# EAGLE design simple-loop-activevrs (EAGLE 6.6.0)

## Sheet 1 of 2
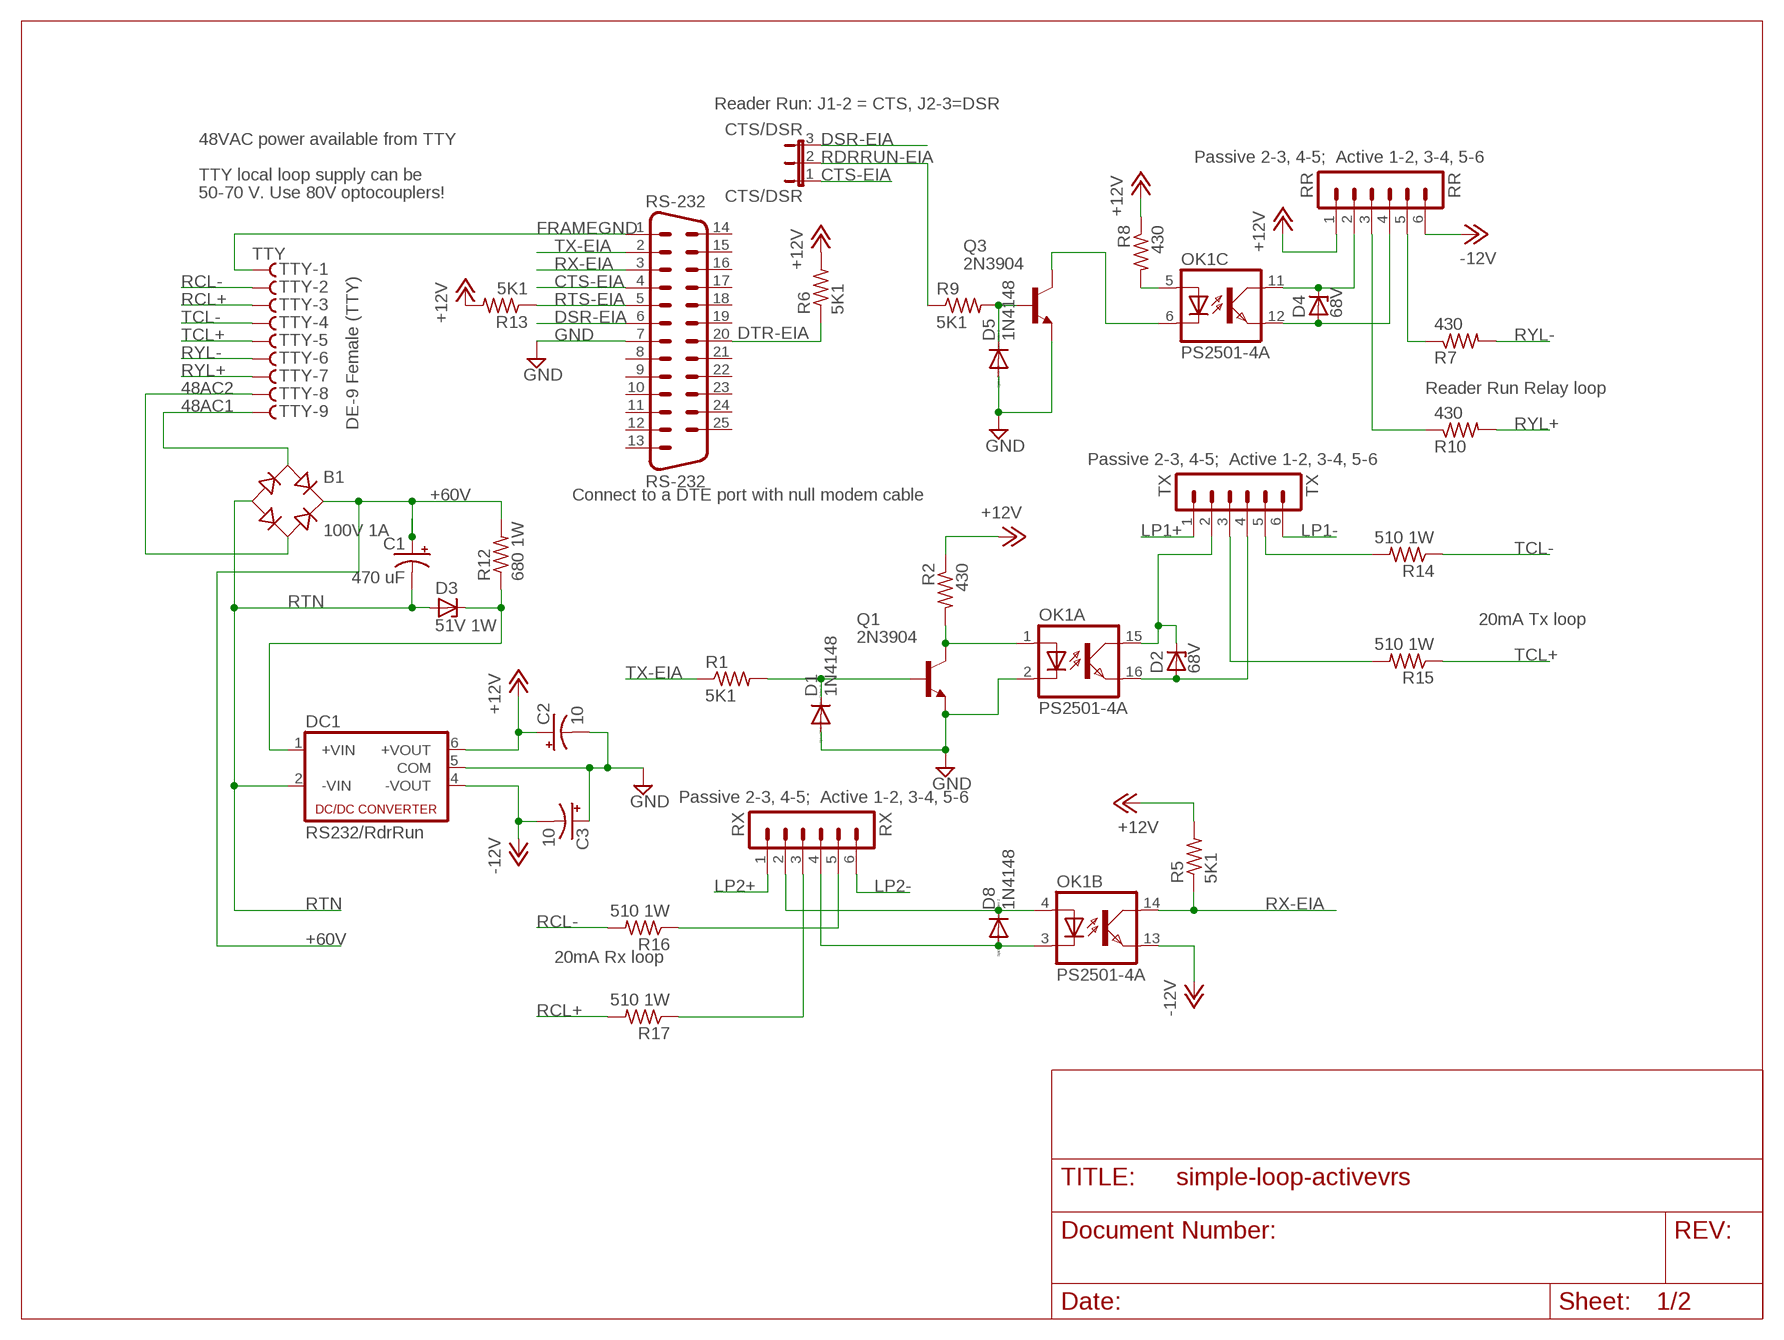
[diagram p0: schematic, sheet 1]

### Parts
B1  100V 1A  RB1A  [RB1A]
C1  470 uF  CPOL-USE7.5-18  [E7,5-18]
C2  10  CPOL-USB45181A  [B45181A]
C3  10  CPOL-USB45181A  [B45181A]
CTS/DSR  CTS/DSR  JP2E  [JP2]
D1  1N4148  1N4148DO35-10  [DO35-10]
D2  68V  ZENER-DIODEDO41Z10  [DO41Z10]
D3  51V 1W  ZENER-DIODEDO41Z10  [DO41Z10]
D4  68V  ZENER-DIODEDO41Z10  [DO41Z10]
D5  1N4148  1N4148DO35-10  [DO35-10]
D8  1N4148  1N4148DO35-10  [DO35-10]
DC1  RS232/RdrRun  NMA  [NMA]
OK1  PS2501-4A  ILQ1  [DIL16]
Q1  2N3904  [TO92]
Q3  2N3904  [TO92]
R1  5K1  R-US_0207/10  [0207/10]
R2  430  R-US_0207/10  [0207/10]
R5  5K1  R-US_0207/10  [0207/10]
R6  5K1  R-US_0207/10  [0207/10]
R7  430  R-US_0207/10  [0207/10]
R8  430  R-US_0207/10  [0207/10]
R9  5K1  R-US_0207/10  [0207/10]
R10  430  R-US_0207/10  [0207/10]
R12  680 1W  R-US_0817/7V  [P0817V]
R13  5K1  R-US_0207/10  [0207/10]
R14  510 1W  R-US_0817/7V  [P0817V]
R15  510 1W  R-US_0817/7V  [P0817V]
R16  510 1W  R-US_0817/7V  [P0817V]
R17  510 1W  R-US_0817/7V  [P0817V]
RR  RR  MA06-1  [MA06-1]
RS-232  RS-232  M25H  [M25H]
RX  RX  MA06-1  [MA06-1]
TTY  TTY  F09HS  [F09H]
TX  TX  MA06-1  [MA06-1]

### Nets
48AC1: B1.AC1 TTY.9
48AC2: B1.AC2 TTY.8
+12V: C2.+ DC1.6(+VOUT) R2.1 R5.2 R6.2 R8.1 R13.2 RR.1
+48VDC: D3.C DC1.1(+VIN) R12.1
+60V: B1.+ C1.+ R12.2 ; also sheet 2
-12V: C3.- DC1.4(-VOUT) OK1.13(B:EMIT) RR.6
CTS-EIA: CTS/DSR.1 RS-232.4
DSR-EIA: CTS/DSR.3 RS-232.6
DTR-EIA: R6.1 RS-232.20
FRAMEGND: RS-232.1 TTY.1
GND [GND]: C2.- C3.+ D1.A D5.A DC1.5(COM) OK1.2(A:C) Q1.3(E) Q3.3(E) RS-232.7
LP1+: TX.1 ; also sheet 2
LP1-: TX.6 ; also sheet 2
LP2+: RX.1 ; also sheet 2
LP2-: RX.6 ; also sheet 2
N$1: D8.C OK1.4(B:A) RX.2
N$2: R16.1 RX.5
N$3: D8.A OK1.3(B:C) RX.4
N$4: D2.A OK1.16(A:EMIT) TX.4
N$5: OK1.5(C:A) R8.2
N$6: D2.C OK1.15(A:COL) TX.2
N$7: D1.C Q1.2(B) R1.2
N$8: D4.C OK1.11(C:COL) RR.2
N$9: OK1.1(A:A) Q1.1(C) R2.2
N$10: R10.1 RR.3
N$11: R7.1 RR.5
N$15: OK1.6(C:C) Q3.1(C)
N$16: D5.C Q3.2(B) R9.2
N$19: R14.2 TX.5
N$20: R17.1 RX.3
N$21: R15.2 TX.3
N$22: D4.A OK1.12(C:EMIT) RR.4
RCL+: R17.2 TTY.3
RCL-: R16.2 TTY.2
RDRRUN-EIA: CTS/DSR.2 R9.1
RTN: B1.- C1.- D3.A DC1.2(-VIN) ; also sheet 2
RTS-EIA: R13.1 RS-232.5
RX-EIA: OK1.14(B:COL) R5.1 RS-232.3
RYL+: R10.2 TTY.7
RYL-: R7.2 TTY.6
TCL+: R15.1 TTY.5
TCL-: R14.1 TTY.4
TX-EIA: R1.1 RS-232.2
Unconnected: RS-232.8 RS-232.9 RS-232.10 RS-232.11 RS-232.12 RS-232.13 RS-232.14 RS-232.15 RS-232.16 RS-232.17 RS-232.18 RS-232.19 RS-232.21 RS-232.22 RS-232.23 RS-232.24 RS-232.25

### Notes on the sheet
- Reader Run: J1-2 = CTS, J2-3=DSR
- 48VAC power available from TTY
- Passive 2-3, 4-5;  Active 1-2, 3-4, 5-6
- TTY local loop supply can be
- 50-70 V. Use 80V optocouplers!
- Reader Run Relay loop
- DE-9 Female (TTY)
- Passive 2-3, 4-5;  Active 1-2, 3-4, 5-6
- Connect to a DTE port with null modem cable
- 20mA Tx loop
- Passive 2-3, 4-5;  Active 1-2, 3-4, 5-6
- 20mA Rx loop

## Sheet 2 of 2
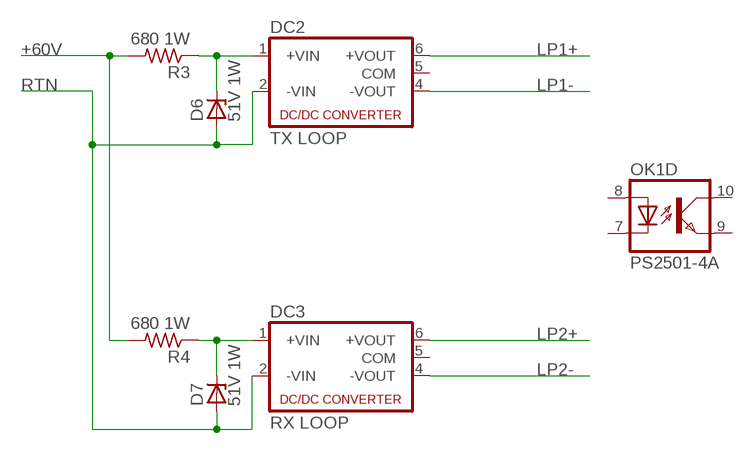
[diagram p1: schematic, sheet 2]

### Parts
D6  51V 1W  ZENER-DIODEDO41Z10  [DO41Z10]
D7  51V 1W  ZENER-DIODEDO41Z10  [DO41Z10]
DC2  TX LOOP  NMA  [NMA]
DC3  RX LOOP  NMA  [NMA]
R3  680 1W  R-US_0817/7V  [P0817V]
R4  680 1W  R-US_0817/7V  [P0817V]

### Nets
+48VDC1: D6.C DC2.1(+VIN) R3.1
+48VDC2: D7.C DC3.1(+VIN) R4.1
+60V: R3.2 R4.2 ; also sheet 1
LP1+: DC2.6(+VOUT) ; also sheet 1
LP1-: DC2.4(-VOUT) ; also sheet 1
LP2+: DC3.6(+VOUT) ; also sheet 1
LP2-: DC3.4(-VOUT) ; also sheet 1
RTN: D6.A D7.A DC2.2(-VIN) DC3.2(-VIN) ; also sheet 1
Unconnected: DC2.5(COM) DC3.5(COM) OK1.7(D:C) OK1.8(D:A) OK1.9(D:EMIT) OK1.10(D:COL)

## Library data of the parts
B1 = rectifier:RB1A: RECTIFIER 1 A
C1-C3 = rcl:CPOL-US: POLARIZED CAPACITOR, American symbol
CTS/DSR = jumper:JP2E: JUMPER
D1 D5 D8 = diode:1N4148: DIODE high speed (Philips)
D2-D4 D6 D7 = diode:ZENER-DIODE: Z-Diode
DC1-DC3 = dc-dc-converter:NMA: DC-DC CONVERTER; MF: C & D TECHNOLOGIES, INC; MPN: NMA0515SC; OC_FARNELL: 1021434; OC_NEWARK: 61K3064
OK1 = optocoupler:ILQ1: SIEMENS OPTO COUPLER; MF: VISHAY/TELEFUNKEN; MPN: ILQ1; OC_FARNELL: 1469501; OC_NEWARK: 88K1954
Q1 Q3 = transistor-npn:2N3904: NPN Transistor
R1-R10 R12-R17 = rcl:R-US_: RESISTOR, American symbol
RR RX TX = con-lstb:MA06-1: PIN HEADER; OC_FARNELL: unknown; OC_NEWARK: unknown
RS-232 = con-subd:M25: SUB-D; OC_FARNELL: unknown; OC_NEWARK: unknown
TTY = con-subd:F09?S: SUB-D; OC_FARNELL: unknown; OC_NEWARK: unknown

## Net classes
1 GND: width 0.508 mm

## Board
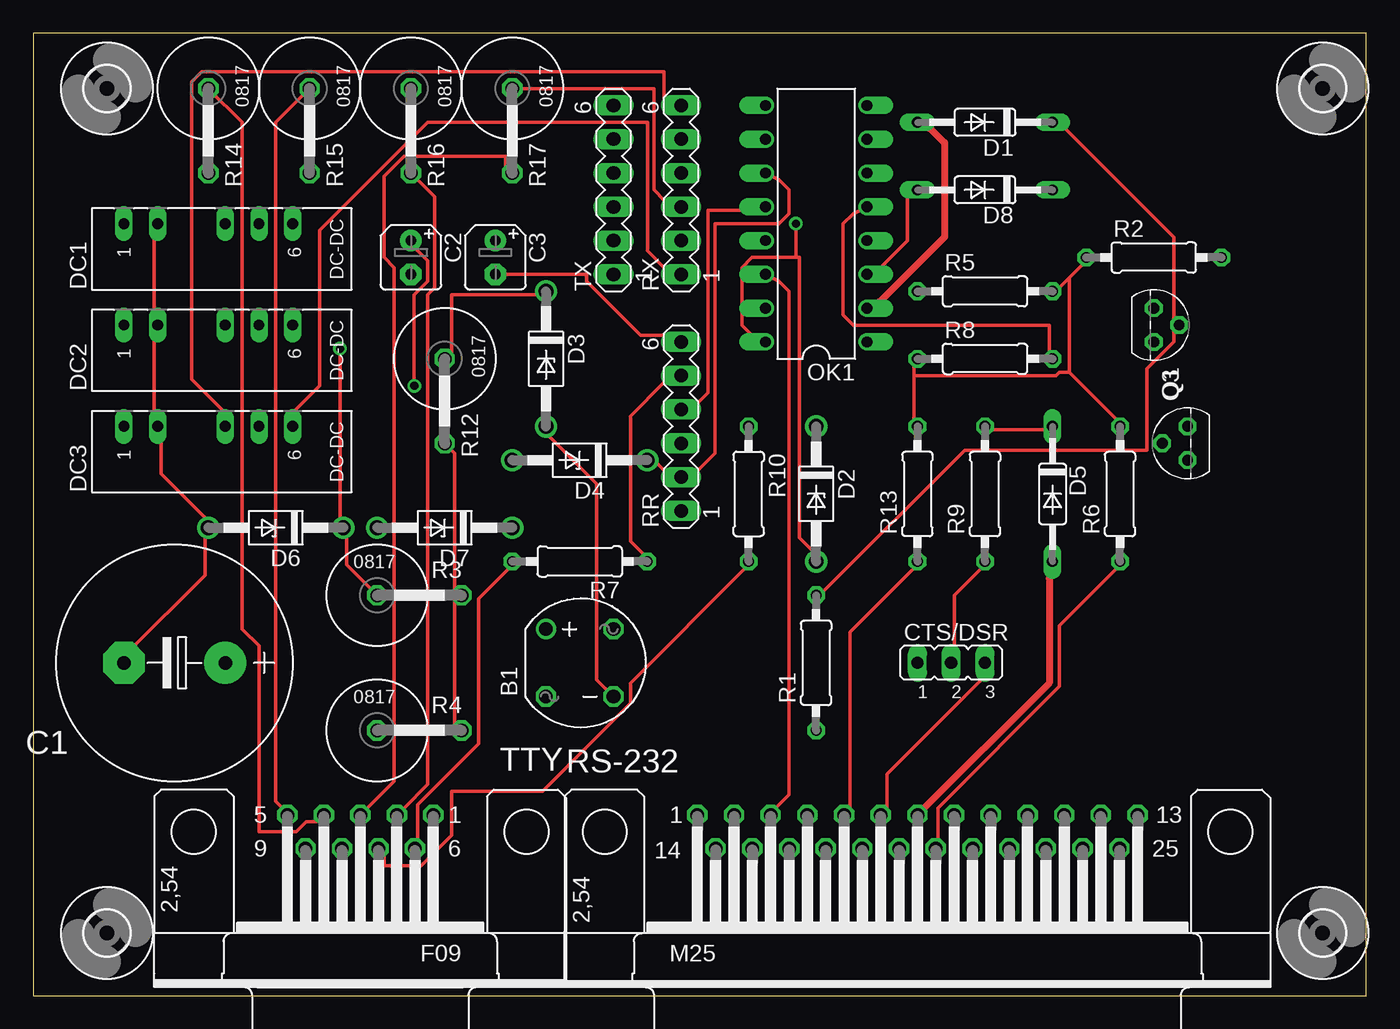
[diagram p2: board, top side]
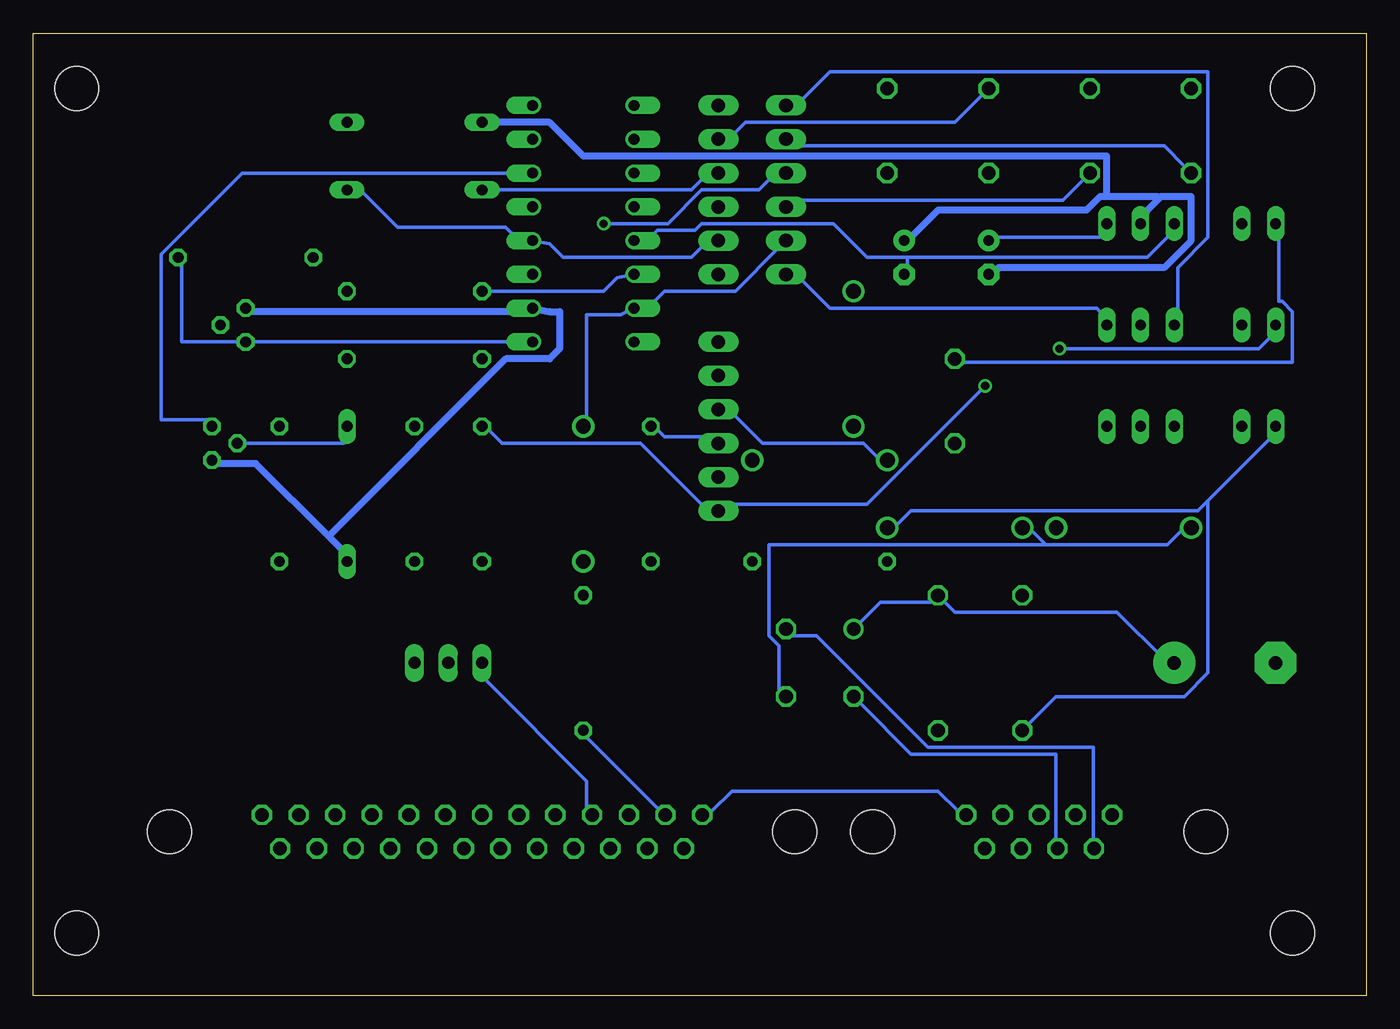
[diagram p3: board, bottom side, seen from below]

Size 100.27 x 72.37 mm. Coordinates in mm from the lower left corner, seen from the top.
Outline: 100.27,0 100.27,72.37 0,72.37 0,0 100.27,0
Copper layers (1*16): Top 0.035mm / dielectric 1.5mm / Bottom 0.035mm
Design rules "10mils *": minimum track width 10mil, minimum drill 24mil, track to track 10mil, track to pad 10mil, pad to pad 10mil, via to via 10mil, smd to smd 10mil, copper to edge 40mil, drill to drill 10mil, minimum pad ring 10mil, minimum via ring 8mil, stop-mask expansion 0mil, vias tented up to drill 0mil, thermal gap 10mil

### Footprints (pad centres in the part's own frame; a part is rotated, then mirrored left to right if it is on the bottom)
RB1A = drill 1.016: + -2.54,2.54 | drill 1.016 octagon: - 2.54,-2.54; AC1 2.54,2.54; AC2 -2.54,-2.54
E7,5-18 = drill 1.016 pad 3.15: + -3.81,0 | drill 1.016 pad 3.15 octagon: - 3.81,0
B45181A = drill 0.813 pad 1.6: + -1.27,0 | drill 0.813 pad 1.6 octagon: - 1.27,0
JP2 = drill 0.914 long: 1 -2.54,0; 2 0,0; 3 2.54,0
DO35-10 = drill 0.813 long: A 5.08,0; C -5.08,0
DO41Z10 = drill 1.118: A 5.08,0; C -5.08,0
NMA = drill 0.813 long: 1 0,6.35; 2 0,3.81; 4 0,-1.27; 5 0,-3.81; 6 0,-6.35
DIL16 = drill 0.813 offset: 1 -8.89,-3.81; 2 -6.35,-3.81; 3 -3.81,-3.81; 4 -1.27,-3.81; 5 1.27,-3.81; 6 3.81,-3.81; 7 6.35,-3.81; 8 8.89,-3.81; 9 8.89,3.81; 10 6.35,3.81; 11 3.81,3.81; 12 1.27,3.81; 13 -1.27,3.81; 14 -3.81,3.81; 15 -6.35,3.81; 16 -8.89,3.81
TO92 = drill 0.813 octagon: 1 1.27,0; 2 0,1.905; 3 -1.27,0
0207/10 = drill 0.813 octagon: 1 -5.08,0; 2 5.08,0
P0817V = drill 1.016 octagon: 1 -5.08,0; 2 1.27,0
MA06-1 = drill 1.016 long: 1 -6.35,0; 2 -3.81,0; 3 -1.27,0; 4 1.27,0; 5 3.81,0; 6 6.35,0
M25H = drill 1.016 octagon: 1 -16.561,1.27; 2 -13.792,1.27; 3 -11.049,1.27; 4 -8.28,1.27; 5 -5.512,1.27; 6 -2.769,1.27; 7 0,1.27; 8 2.769,1.27; 9 5.512,1.27; 10 8.28,1.27; 11 11.049,1.27; 12 13.792,1.27; 13 16.561,1.27; 14 -15.189,-1.27; 15 -12.421,-1.27; 16 -9.652,-1.27; 17 -6.909,-1.27; 18 -4.14,-1.27; 19 -1.372,-1.27; 20 1.372,-1.27; 21 4.14,-1.27; 22 6.909,-1.27; 23 9.652,-1.27; 24 12.421,-1.27; 25 15.189,-1.27 | hole 3.302: 23.52,0; -23.52,0
F09H = drill 1.016 octagon: 1 -5.486,-1.27; 2 -2.743,-1.27; 3 0,-1.27; 4 2.743,-1.27; 5 5.486,-1.27; 6 -4.115,1.27; 7 -1.372,1.27; 8 1.372,1.27; 9 4.115,1.27 | hole 3.302: -12.522,0; 12.522,0
3,3 = hole 3.3: 0,0

### Placement (x,y rotation side)
B1  41.11,25.03 0 top
C1  10.63,25.03 180 top
C2  28.41,55.51 270 top
C3  34.76,55.51 270 top
CTS/DSR  69.05,25.03 0 top
D1  71.59,65.67 180 top
D2  58.89,37.73 270 top
D3  38.57,47.89 270 top
D4  41.11,40.27 180 top
D5  76.67,37.73 270 top
D6  18.25,35.19 180 top
D7  30.95,35.19 180 top
D8  71.59,60.59 180 top
DC1  13.17,58.05 90 top
DC2  13.17,50.43 90 top
DC3  13.17,42.81 90 top
OK1  58.89,58.05 90 top
Q1  84.29,50.43 270 top
Q3  86.83,41.54 90 top
R1  58.89,25.03 90 top
R2  84.29,55.51 0 top
R3  30.95,30.11 0 top
R4  30.95,19.95 0 top
R5  71.59,52.97 0 top
R6  81.75,37.73 90 top
R7  41.11,32.65 180 top
R8  71.59,47.89 0 top
R9  71.59,37.73 90 top
R10  53.81,37.73 270 top
R12  30.95,42.81 270 top
R13  66.51,37.73 90 top
R14  13.17,63.13 270 top
R15  20.79,63.13 270 top
R16  28.41,63.13 270 top
R17  36.03,63.13 270 top
RR  48.73,42.81 90 top
RS-232  66.51,12.33 0 top
RX  48.73,60.59 90 top
TTY  24.6,12.33 180 top
TX  43.65,60.59 90 top
U$1  [3,3]  5.55,68.21 0 top
U$2  [3,3]  5.55,4.71 0 top
U$3  [3,3]  96.99,68.21 0 top
U$4  [3,3]  96.99,4.71 0 top

### Tracks (layer width: path | path; a pad name or v marks a point on that pad's centre or on a via)
48AC1
  Bottom 0.254: TTY.9 20.54,11.57 20.54,18.68 32.98,18.68 41.36,27.06 43.14,27.06 B1.AC1
48AC2
  Bottom 0.254: TTY.8 23.33,11.57 23.33,18.17 34.25,18.17 38.06,21.98 B1.AC2
+12V  (via drill 0.61)
  Top 0.254: 77.94,53.99 78.96,55 R2.1 | 77.94,53.99 77.18,53.22 R5.2 | 77.94,46.87 81.5,43.32 R6.2 | 77.94,46.87 77.94,53.99 | 66.26,46.62 66.26,47.38 R8.1 | 66.26,46.62 66.26,43.32 R13.2 | v28.66,45.86 28.66,52.72 29.68,53.73 29.68,55.26 28.66,56.27 C2.+ | 77.94,46.87 77.18,46.87 76.92,46.62 66.26,46.62
  Bottom 0.254: C2.+ 27.9,57.03 20.03,57.03 DC1.6 | R13.2 66,42.56 64.99,41.54 54.57,41.54 50,36.97 RR.1 47.46,36.97 37.55,36.97 v28.66,45.86
+48VDC
  Top 0.254: D3.C 37.81,52.72 31.46,52.72 31.46,48.4 R12.1
  Bottom 0.254: DC1.1 6.57,56.78 6.57,52.21 6.31,52.21 5.55,51.45 5.55,47.64 30.44,47.64 R12.1
+48VDC1  (via drill 0.61)
  Top 0.254: v23.08,48.65 23.08,35.95 D6.C 23.58,34.43 23.58,32.4 25.36,30.62 R3.1
  Bottom 0.254: v23.08,48.65 8.09,48.65 7.33,49.41 DC2.1
+48VDC2
  Bottom 0.254: 11.9,37.22 12.66,36.46 34.25,36.46 35.27,35.44 D7.C | 11.9,37.22 7.33,41.79 DC3.1 | R4.1 23.33,22.49 13.68,22.49 11.9,24.27 11.9,37.22
+60V
  Top 0.254: R4.2 31.71,20.46 31.71,29.6 R3.2 31.71,30.62 31.71,40.78 R12.2
  Bottom 0.254: B1.+ 36.54,29.6 32.73,29.6 R3.2 30.95,28.84 18.76,28.84 15.2,25.28 C1.+
-12V
  Top 0.254: C3.- 41.62,54.24 41.62,53.73 45.68,49.67 47.46,49.67 RR.6
  Bottom 0.254: OK1.13 53.81,57.03 53.3,57.54 50.51,57.54 50,58.05 40.09,58.05 37.55,55.51 34.51,55.51 | 34.51,55.51 16.47,55.51 14.95,57.03 DC1.4 | 34.51,55.51 34.51,54.75 C3.-
CTS-EIA
  Bottom 0.254: CTS/DSR.1 66.26,23.76 58.64,16.14 58.64,14.11 RS-232.4
DSR-EIA
  Top 0.254: CTS/DSR.3 71.34,23.76 64.22,16.65 64.22,14.11 RS-232.6
DTR-EIA
  Top 0.254: R6.1 81.5,32.14 77.18,27.82 77.18,23.25 68.03,14.11 68.03,11.57 RS-232.20
FRAMEGND
  Bottom 0.254: TTY.1 30.7,13.85 32.22,15.38 47.71,15.38 49.24,13.85 RS-232.1
GND
  Top 0.508: RS-232.7 76.42,23.51 76.42,31.38 D5.A | OK1.2 63.72,52.21 68.54,57.03 68.54,64.15 67.53,65.16 D1.A
  Bottom 0.508: 78.07,34.55 83.53,40.02 86.32,40.02 Q3.3 | 78.07,34.55 77.18,33.67 D5.A | Q1.3 83.78,51.45 63.97,51.45 OK1.2 61.43,51.45 60.67,51.45 60.67,48.65 61.43,47.89 64.73,47.89 78.07,34.55 | 15.58,59.96 16.47,59.07 DC1.5 | 15.58,59.96 15.46,60.08 13.17,60.08 13.17,56.78 15.2,54.75 27.65,54.75 27.9,54.49 C2.- | 19.52,60.08 15.71,60.08 15.58,59.96 | 19.52,60.08 20.03,60.08 21.04,59.07 32.22,59.07 34.25,57.03 C3.+ | 19.52,60.08 19.52,63.13 58.89,63.13 61.43,65.67 D1.A
LP1+
  Bottom 0.254: DC2.6 20.03,51.45 20.28,51.7 40.35,51.7 42.38,53.73 TX.1
LP1-
  Bottom 0.254: DC2.4 14.19,51.7 14.19,54.75 11.9,57.03 11.9,69.48 40.35,69.48 42.38,67.45 TX.6
LP2+
  Top 0.254: DC3.6 19.77,44.08 21.55,45.86 21.55,57.54 29.68,65.67 46.19,65.67 46.19,56.02 47.46,54.75 RX.1
LP2-
  Top 0.254: DC3.4 14.19,44.08 11.9,46.37 11.9,68.72 12.66,69.48 47.46,69.48 47.46,67.45 RX.6
N$1
  Bottom 0.254: RX.2 50,56.27 50.76,55.51 60.41,55.51 61.43,56.53 OK1.4 63.97,57.03 64.73,57.8 72.86,57.8 75.4,60.34 D8.C
N$2
  Bottom 0.254: R16.1 28.92,67.7 30.95,65.67 46.7,65.67 47.46,64.91 RX.5
N$3
  Top 0.254: OK1.3 63.72,54.75 65.75,56.78 65.75,60.08 D8.A
  Bottom 0.254: RX.4 50,61.35 50.76,60.59 65.24,60.59 D8.A
N$4  (via drill 0.61)
  Top 0.254: 57.37,55.51 57.62,55.51 57.62,34.43 58.64,33.41 D2.A | 57.37,55.51 54.06,55.51 53.3,54.75 53.3,50.43 54.06,49.67 OK1.16 | 57.37,55.51 v57.37,58.05
  Bottom 0.254: v57.37,58.05 52.54,58.05 50,60.59 45.68,60.59 44.92,61.35 TX.4
N$5
  Top 0.254: OK1.5 61.68,58.81 60.92,58.05 60.92,51.19 61.68,50.43 76.42,50.43 76.42,48.4 R8.2
N$6
  Bottom 0.254: TX.2 44.16,56.27 47.46,52.97 52.79,52.97 53.81,51.95 OK1.15 56.1,51.19 58.64,51.19 58.64,43.57 D2.C
N$7
  Top 0.254: R1.2 59.4,30.36 70.07,41.03 83.78,41.03 83.78,47.13 85.81,49.16 85.81,49.92 Q1.2 85.81,50.94 85.81,57.03 77.69,65.16 D1.C
N$8
  Top 0.254: OK1.11 56.1,61.35 56.86,60.59 56.86,58.81 56.1,58.05 51.27,58.05 51.27,40.78 50,39.51 RR.2 47.46,39.51 46.95,40.02 D4.C
N$9
  Bottom 0.254: OK1.1 63.97,49.16 83.78,49.16 Q1.1 84.8,49.16 89.12,49.16 89.12,55 R2.2
N$10
  Bottom 0.254: R10.1 53.3,42.56 52.79,42.05 50,42.05 RR.3
N$11
  Top 0.254: R7.1 45.94,33.16 44.92,34.17 44.92,43.57 47.46,46.11 RR.5
N$15
  Bottom 0.254: OK1.6 63.97,61.86 84.54,61.86 90.64,55.76 90.64,43.32 87.08,43.32 Q3.1
N$16
  Top 0.254: R9.2 72.1,42.56 76.16,42.56 D5.C
  Bottom 0.254: Q3.2 84.29,41.54 76.92,41.54 D5.C
N$19
  Bottom 0.254: R14.2 13.68,62.37 15.2,63.89 42.38,63.89 TX.5
N$20
  Top 0.254: R17.1 36.54,68.21 46.7,68.21 46.7,60.59 47.46,59.83 RX.3
N$21
  Bottom 0.254: R15.2 21.3,61.35 22.82,59.83 42.38,59.83 TX.3
N$22
  Top 0.254: OK1.12 53.81,59.07 50.76,59.07 50.76,45.35 50,44.59 RR.4
  Bottom 0.254: D4.A 36.79,40.52 37.81,41.54 45.43,41.54 47.46,43.57 RR.4
RCL+
  Top 0.254: TTY.3 25.11,14.11 27.14,16.14 27.14,54.75 26.38,55.51 26.38,61.61 27.9,63.13 35.52,63.13 35.52,62.37 R17.2
RCL-
  Top 0.254: R16.2 30.19,60.08 30.19,53.22 29.68,52.72 29.68,15.89 27.9,14.11 TTY.2
RDRRUN-EIA
  Top 0.254: R9.1 71.34,32.14 69.3,30.11 69.3,26.3 CTS/DSR.2
RTN
  Top 0.254: DC1.2 9.11,56.78 9.11,51.7 DC2.2 9.11,49.16 9.11,44.08 DC3.2 9.61,41.54 9.61,39.25 12.92,35.95 D6.A 12.92,34.43 12.92,31.63 7.07,25.79 C1.- | B1.- 42.38,23.76 42.38,38.49 38.82,42.05 D3.A
  Bottom 0.254: 24.09,33.92 25.11,34.94 D7.A | 24.09,33.92 14.95,33.92 13.93,34.94 D6.A | 24.09,33.92 44.92,33.92 44.92,27.06 44.16,26.3 44.16,23 B1.-
RTS-EIA
  Top 0.254: R13.1 66.26,32.14 61.43,27.32 61.43,14.11 RS-232.5
RX-EIA
  Top 0.254: RS-232.3 55.84,14.11 56.86,15.12 56.86,52.97 56.1,53.73 OK1.14
  Bottom 0.254: OK1.14 56.35,53.99 57.37,52.97 66,52.97 R5.1
RYL+
  Top 0.254: R10.2 53.56,32.14 44.92,23.51 44.92,21.98 38.32,15.38 31.46,15.38 31.46,12.08 29.17,9.79 26.38,9.79 26.38,10.55 TTY.7
RYL-
  Top 0.254: R7.2 35.78,32.14 33.49,29.86 33.49,18.93 28.92,14.36 28.92,11.57 TTY.6
TCL+
  Top 0.254: TTY.5 18.76,14.11 18.25,14.62 18.25,65.67 20.28,67.7 R15.1
TCL-
  Top 0.254: R14.1 15.71,65.67 15.71,27.57 16.98,26.3 16.98,12.33 19.77,12.33 20.54,13.09 21.3,13.09 TTY.4
TX-EIA
  Bottom 0.254: R1.1 58.64,19.44 53.3,14.11 53.05,14.11 RS-232.2

### Text on the board
tValues: TX,RX,RR: 2-3,4-5 PASSIVE/1-2,3-4,5-6 ACTIVE | J1-2=CTS, J2-3=DSR | RS232-Current Loop 20mA | (c)2006 CEM & VRS